# Altium project Main Board.PrjPcb
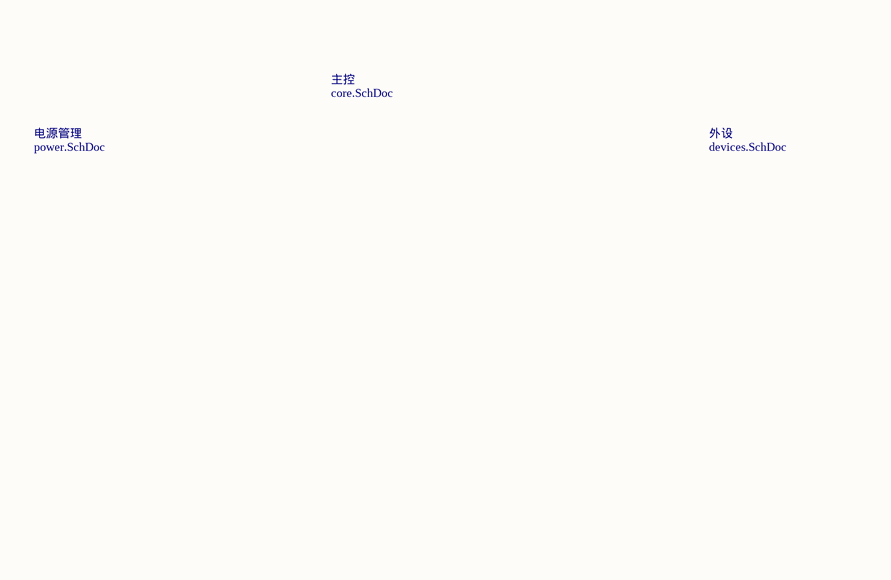
[diagram p0: main.SchDoc]
4 sheets, 71 parts. Net scope: flat (ports and power ports of the same name join across sheets).
Board file: main_board.PcbDoc
Sheets:
  main.SchDoc
    主控 = core.SchDoc
    电源管理 = power.SchDoc
    外设 = devices.SchDoc

## Sheet main.SchDoc
size A4

### Parts
LOGO1  (no value)  [JMU_LOGO(1.35cm)]

### Sub-sheets
主控 = core.SchDoc: no entries
外设 = devices.SchDoc: no entries
电源管理 = power.SchDoc: no entries

### Library data of the parts
LOGO1 = JMU_LOGO: LOGO

## Sheet core.SchDoc
size A4
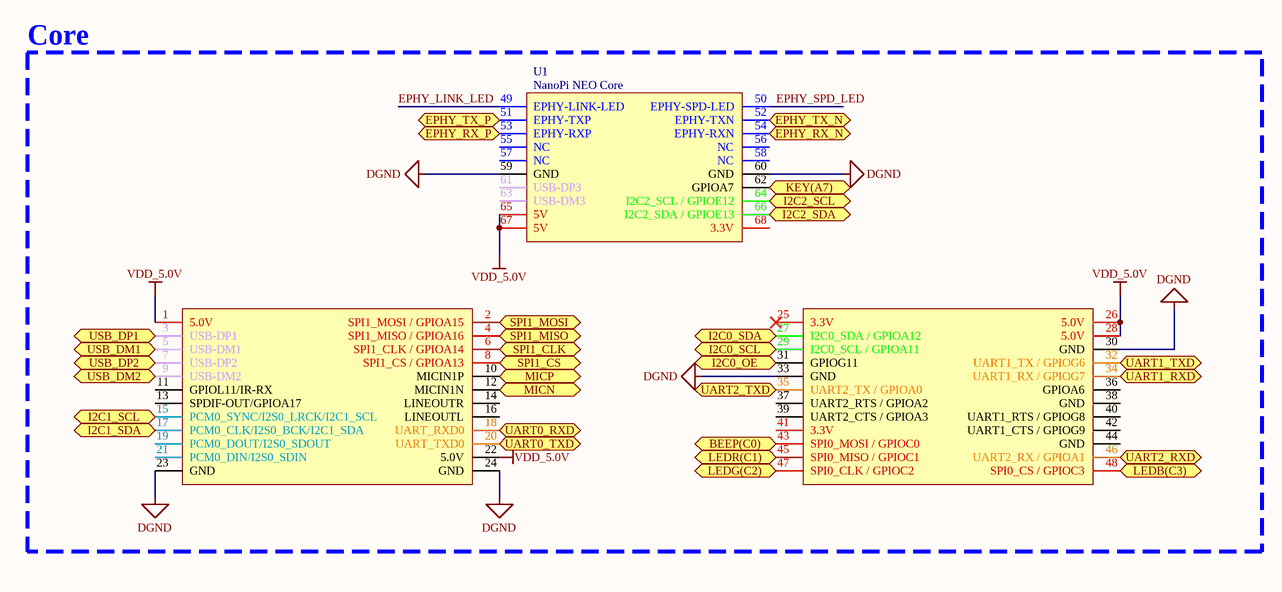
[diagram p1: core.SchDoc]

### Parts
U1  NanoPi NEO Core  [NanoPi NEO Core]

### Ports
BEEP(C0), EPHY_RX_N, EPHY_RX_P, EPHY_TX_N, EPHY_TX_P, I2C0_OE, I2C0_SCL, I2C0_SDA, I2C1_SCL, I2C1_SDA, I2C2_SCL, I2C2_SDA, KEY(A7), LEDB(C3), LEDG(C2), LEDR(C1), MICN, MICP, SPI1_CLK, SPI1_CS, SPI1_MISO, SPI1_MOSI, UART0_RXD, UART0_TXD, UART1_RXD, UART1_TXD, UART2_RXD, UART2_TXD, USB_DM1, USB_DM2, USB_DP1, USB_DP2

### Nets
DGND: U1.23(GND) U1.24(GND) U1.30(GND) U1.33(GND) U1.59(GND) U1.60(GND)
VDD_5.0V: U1.1(5.0V) U1.22(5.0V) U1.26(5.0V) U1.28(5.0V) U1.65(5V) U1.67(5V)
BEEP(C0): U1.43(SPI0_MOSI_/_GPIOC0) ; port BEEP(C0)
EPHY_LINK_LED: U1.49(EPHY-LINK-LED)
EPHY_SPD_LED: U1.50(EPHY-SPD-LED)
I2C0_OE: U1.31(GPIOG11) ; port I2C0_OE
I2C0_SCL: U1.29(I2C0_SCL_/_GPIOA11) ; port I2C0_SCL
I2C0_SDA: U1.27(I2C0_SDA_/_GPIOA12) ; port I2C0_SDA
I2C1_SCL: U1.15(PCM0_SYNC/I2S0_LRCK/I2C1_SCL) ; port I2C1_SCL
I2C1_SDA: U1.17(PCM0_CLK/I2S0_BCK/I2C1_SDA) ; port I2C1_SDA
I2C2_SCL: U1.64(I2C2_SCL_/_GPIOE12) ; port I2C2_SCL
I2C2_SDA: U1.66(I2C2_SDA_/_GPIOE13) ; port I2C2_SDA
KEY(A7): U1.62(GPIOA7) ; port KEY(A7)
LEDB(C3): U1.48(SPI0_CS_/_GPIOC3) ; port LEDB(C3)
LEDG(C2): U1.47(SPI0_CLK_/_GPIOC2) ; port LEDG(C2)
LEDR(C1): U1.45(SPI0_MISO_/_GPIOC1) ; port LEDR(C1)
MICN: U1.12(MICIN1N) ; port MICN
MICP: U1.10(MICIN1P) ; port MICP
RXIN: U1.54(EPHY-RXN) ; port EPHY_RX_N
RXIP: U1.53(EPHY-RXP) ; port EPHY_RX_P
SPI1_CLK: U1.6(SPI1_CLK_/_GPIOA14) ; port SPI1_CLK
SPI1_CS: U1.8(SPI1_CS_/_GPIOA13) ; port SPI1_CS
SPI1_MISO: U1.4(SPI1_MISO_/_GPIOA16) ; port SPI1_MISO
SPI1_MOSI: U1.2(SPI1_MOSI_/_GPIOA15) ; port SPI1_MOSI
TXON: U1.52(EPHY-TXN) ; port EPHY_TX_N
TXOP: U1.51(EPHY-TXP) ; port EPHY_TX_P
UART0_RXD: U1.18(UART_RXD0) ; port UART0_RXD
UART0_TXD: U1.20(UART_TXD0) ; port UART0_TXD
UART1_RXD: U1.34(UART1_RX_/_GPIOG7) ; port UART1_RXD
UART1_TXD: U1.32(UART1_TX_/_GPIOG6) ; port UART1_TXD
UART2_RXD: U1.46(UART2_RX_/_GPIOA1) ; port UART2_RXD
UART2_TXD: U1.35(UART2_TX_/_GPIOA0) ; port UART2_TXD
USB_DM1: U1.5(USB-DM1) ; port USB_DM1
USB_DM2: U1.9(USB-DM2) ; port USB_DM2
USB_DP1: U1.3(USB-DP1) ; port USB_DP1
USB_DP2: U1.7(USB-DP2) ; port USB_DP2

Not connected (* = marked no-connect by the designer): U1 11(GPIOL11/IR-RX) 13(SPDIF-OUT/GPIOA17) 14(LINEOUTR) 16(LINEOUTL) 19(PCM0_DOUT/I2S0_SDOUT) 21(PCM0_DIN/I2S0_SDIN) 25(3.3V)* 36(GPIOA6) 37(UART2_RTS_/_GPIOA2) 38(GND) 39(UART2_CTS_/_GPIOA3) 40(UART1_RTS_/_GPIOG8) 41(3.3V) 42(UART1_CTS_/_GPIOG9) 44(GND) 55(NC) 56(NC) 57(NC) 58(NC) 61(USB-DP3) 63(USB-DM3) 68(3.3V)

### Notes on the sheet
- Core

## Sheet power.SchDoc
size A3
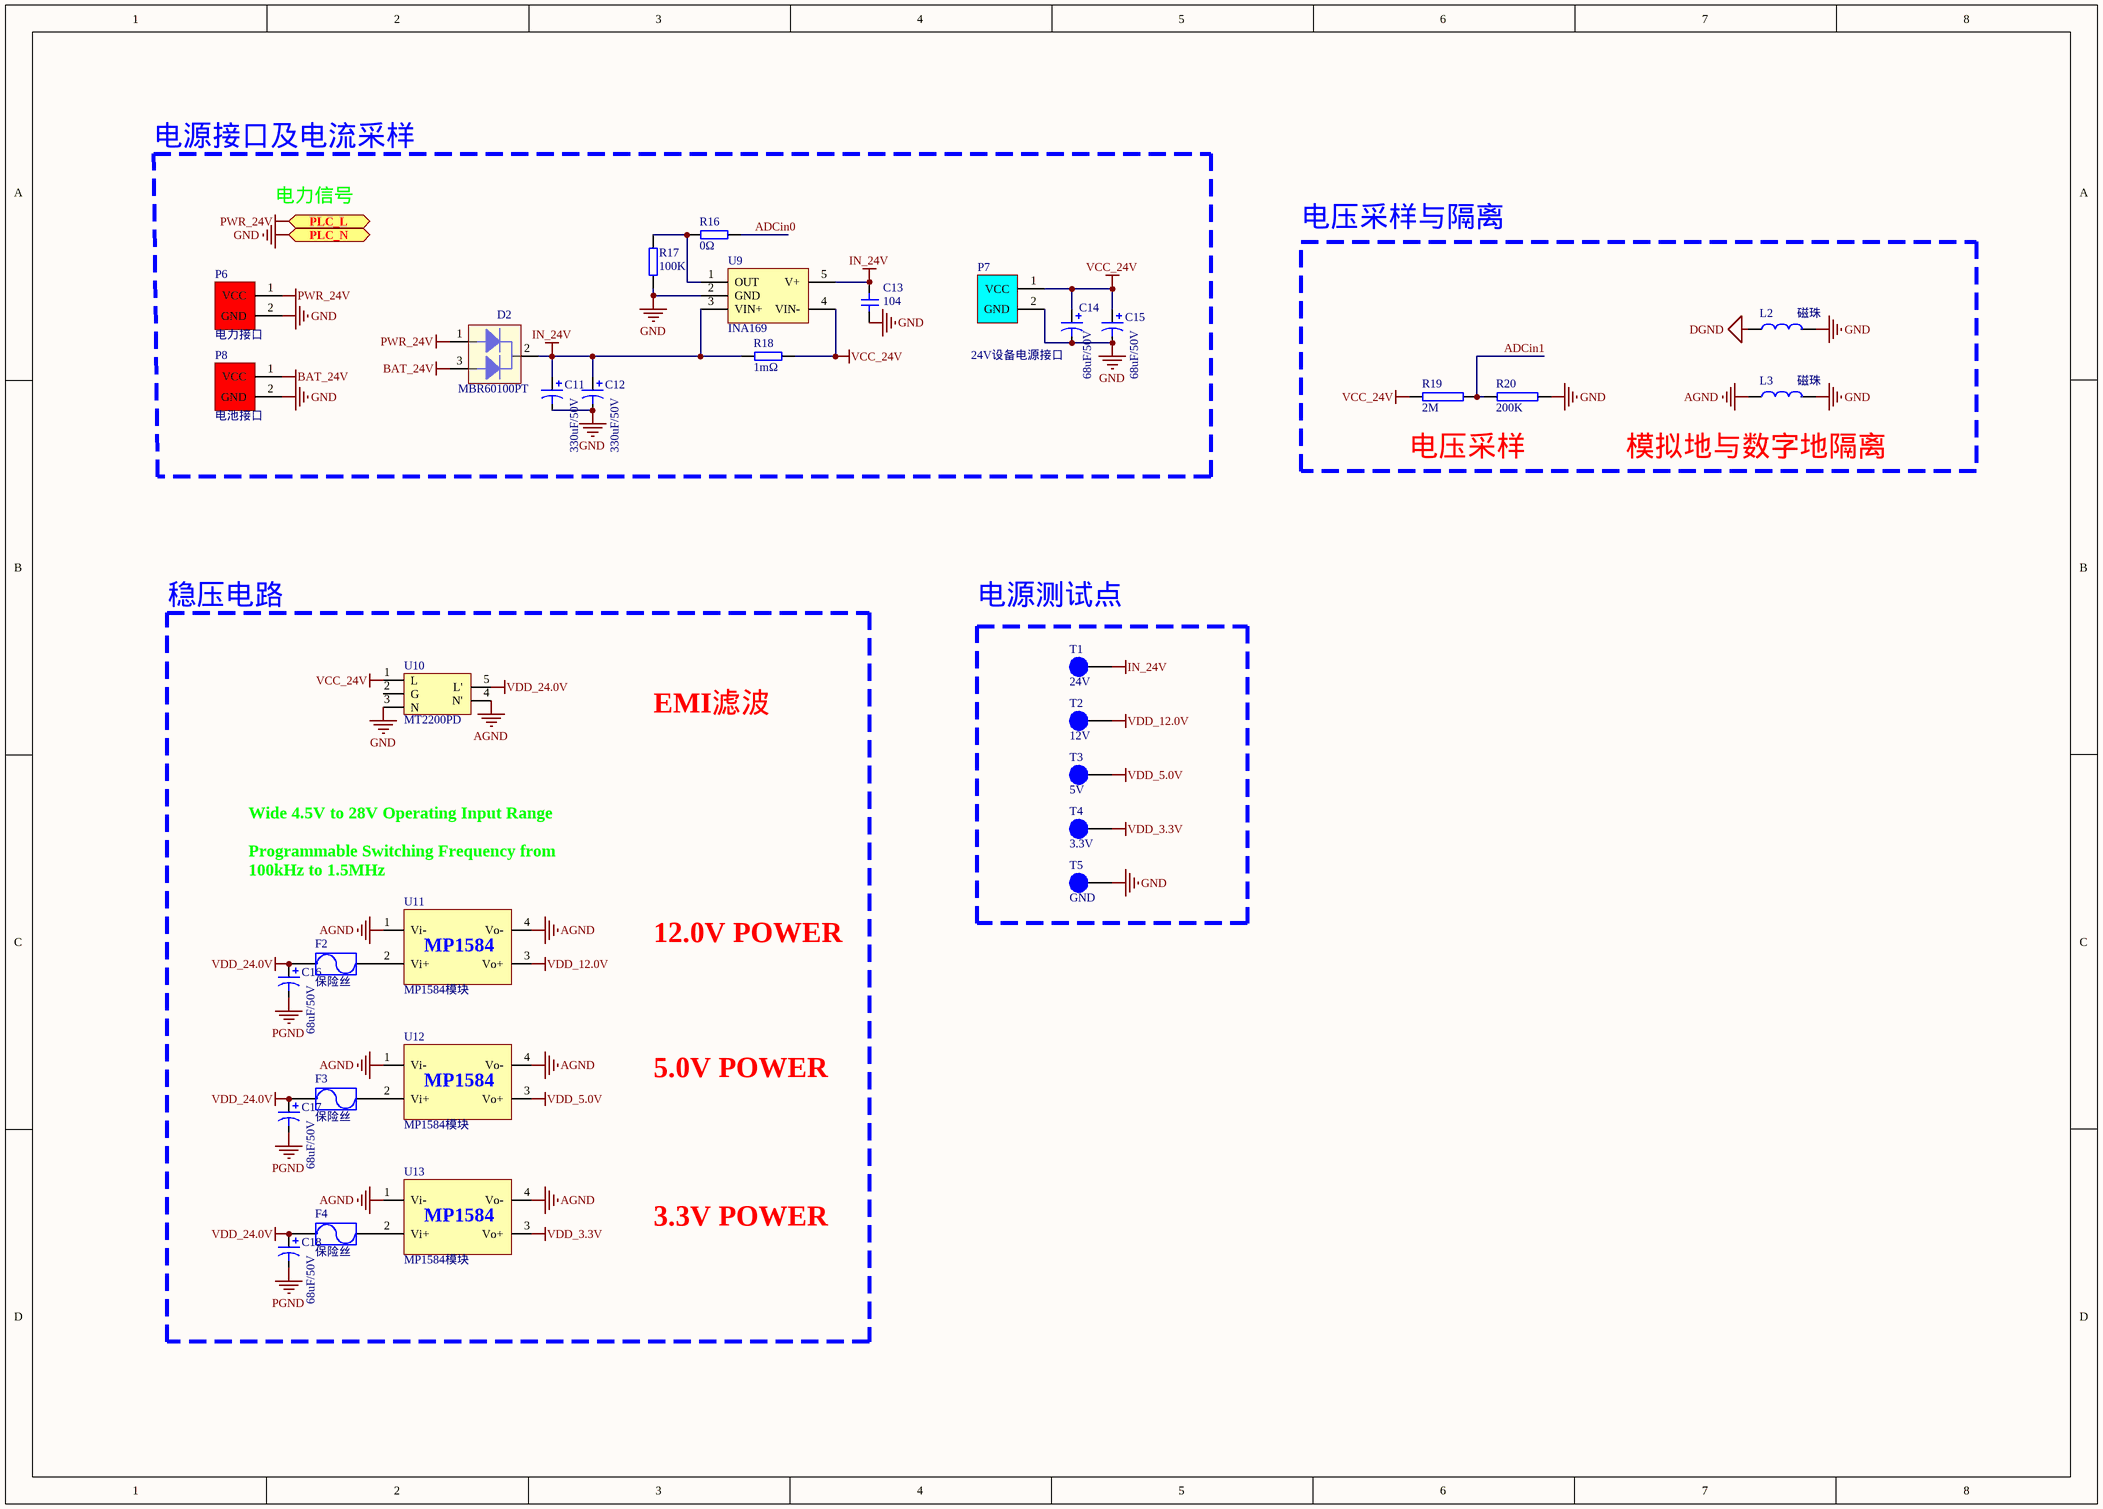
[diagram p2: power.SchDoc]

### Parts
C11  330uF/50V  [RB.2.4]
C12  330uF/50V  [RB.2.4]
C13  104  [0805C]
C14  68uF/50V  [RB.1.2]
C15  68uF/50V  [RB.1.2]
C16  68uF/50V  [RB.1.2]
C17  68uF/50V  [RB.1.2]
C18  68uF/50V  [RB.1.2]
D2  MBR60100PT  [TO-247LS]
F2  保险丝  [FUSE-1812]
F3  保险丝  [FUSE-1812]
F4  保险丝  [FUSE-1812]
L2  磁珠  [1206L]
L3  磁珠  [1206L]
P6  电力接口  [XT60-F]
P7  24V设备电源接口  [XT60-F]
P8  电池接口  [XT60-F]
R16  0Ω  [0805R]
R17  100K  [0805R]
R18  1mΩ  [2512R]
R19  2M  [0805R]
R20  200K  [0805R]
T1  24V  [HEADER 1]
T2  12V  [HEADER 1]
T3  5V  [HEADER 1]
T4  3.3V  [HEADER 1]
T5  GND  [HEADER 1]
U9  INA169  [SOT23-5]
U10  MT2200PD  [MT2200PD-6A]
U11  MP1584模块  [MP1584电源模块]
U12  MP1584模块  [MP1584电源模块]
U13  MP1584模块  [MP1584电源模块]

### Blocks framed on the sheet
电源接口及电流采样: C11-C15 D2 P6-P8 R16-R18 U9
电源测试点: T1-T5

### Ports
PLC_L, PLC_N

### Nets
AGND: L3.1 U10.4(N') U11.1(Vi-) U11.4(Vo-) U12.1(Vi-) U12.4(Vo-) U13.1(Vi-) U13.4(Vo-)
BAT_24V: D2.3 P8.1(VCC)
DGND: L2.1
GND: C11.2 C12.2 C13.1 C14.2 C15.2 L2.2 L3.2 P6.2(GND) P7.2(GND) P8.2(GND) R17.1 R20.2 T5.1 U9.2(GND) U10.3(N) ; port PLC_N
IN_24V: C11.1 C12.1 C13.2 D2.2 R18.2 T1.1 U9.3(VIN+) U9.5(V+)
PGND: C16.2 C17.2 C18.2
PWR_24V: D2.1 P6.1(VCC) ; port PLC_L
VCC_24V: C14.1 C15.1 P7.1(VCC) R18.1 R19.1 U9.4(VIN-) U10.1(L)
VDD_3.3V: T4.1 U13.3(Vo+)
VDD_5.0V: T3.1 U12.3(Vo+)
VDD_12.0V: T2.1 U11.3(Vo+)
VDD_24.0V: C16.1 C17.1 C18.1 F2.1 F3.1 F4.1 U10.5(L')
ADCin0: R16.1
ADCin1: R19.2 R20.1
NetF2_2: F2.2 U11.2(Vi+)
NetF3_2: F3.2 U12.2(Vi+)
NetF4_2: F4.2 U13.2(Vi+)
NetR16_2: R16.2 R17.2 U9.1(OUT)

Not connected (* = marked no-connect by the designer): U10 2(G)

### Notes on the sheet
- 电力信号
- 电压采样与隔离
- 电压采样
- (near L3) 模拟地与数字地隔离
- 稳压电路
- EMI滤波
- (near U11) Wide 4.5V to 28V Operating Input Range
  Programmable Switching Frequency from
  100kHz to 1.5MHz
- 12.0V POWER
- 5.0V POWER
- 3.3V POWER
- (in symbol MP1584电源模块) MP1584

### Library data of the parts
C11 C12 C14-C18 = Cap3: 直插极性电容
C13 = Cap1: 无极贴片电容
F2-F4 = Fuse
L2 L3 = L: 电感
P6 P8 = 电源端子
P7 = 推进器电源
R16-R18 = Res: 电阻
R19 R20 = R1
T1-T5 = 测试点
U11-U13 = MP1584电源模块

## Sheet devices.SchDoc
size A3
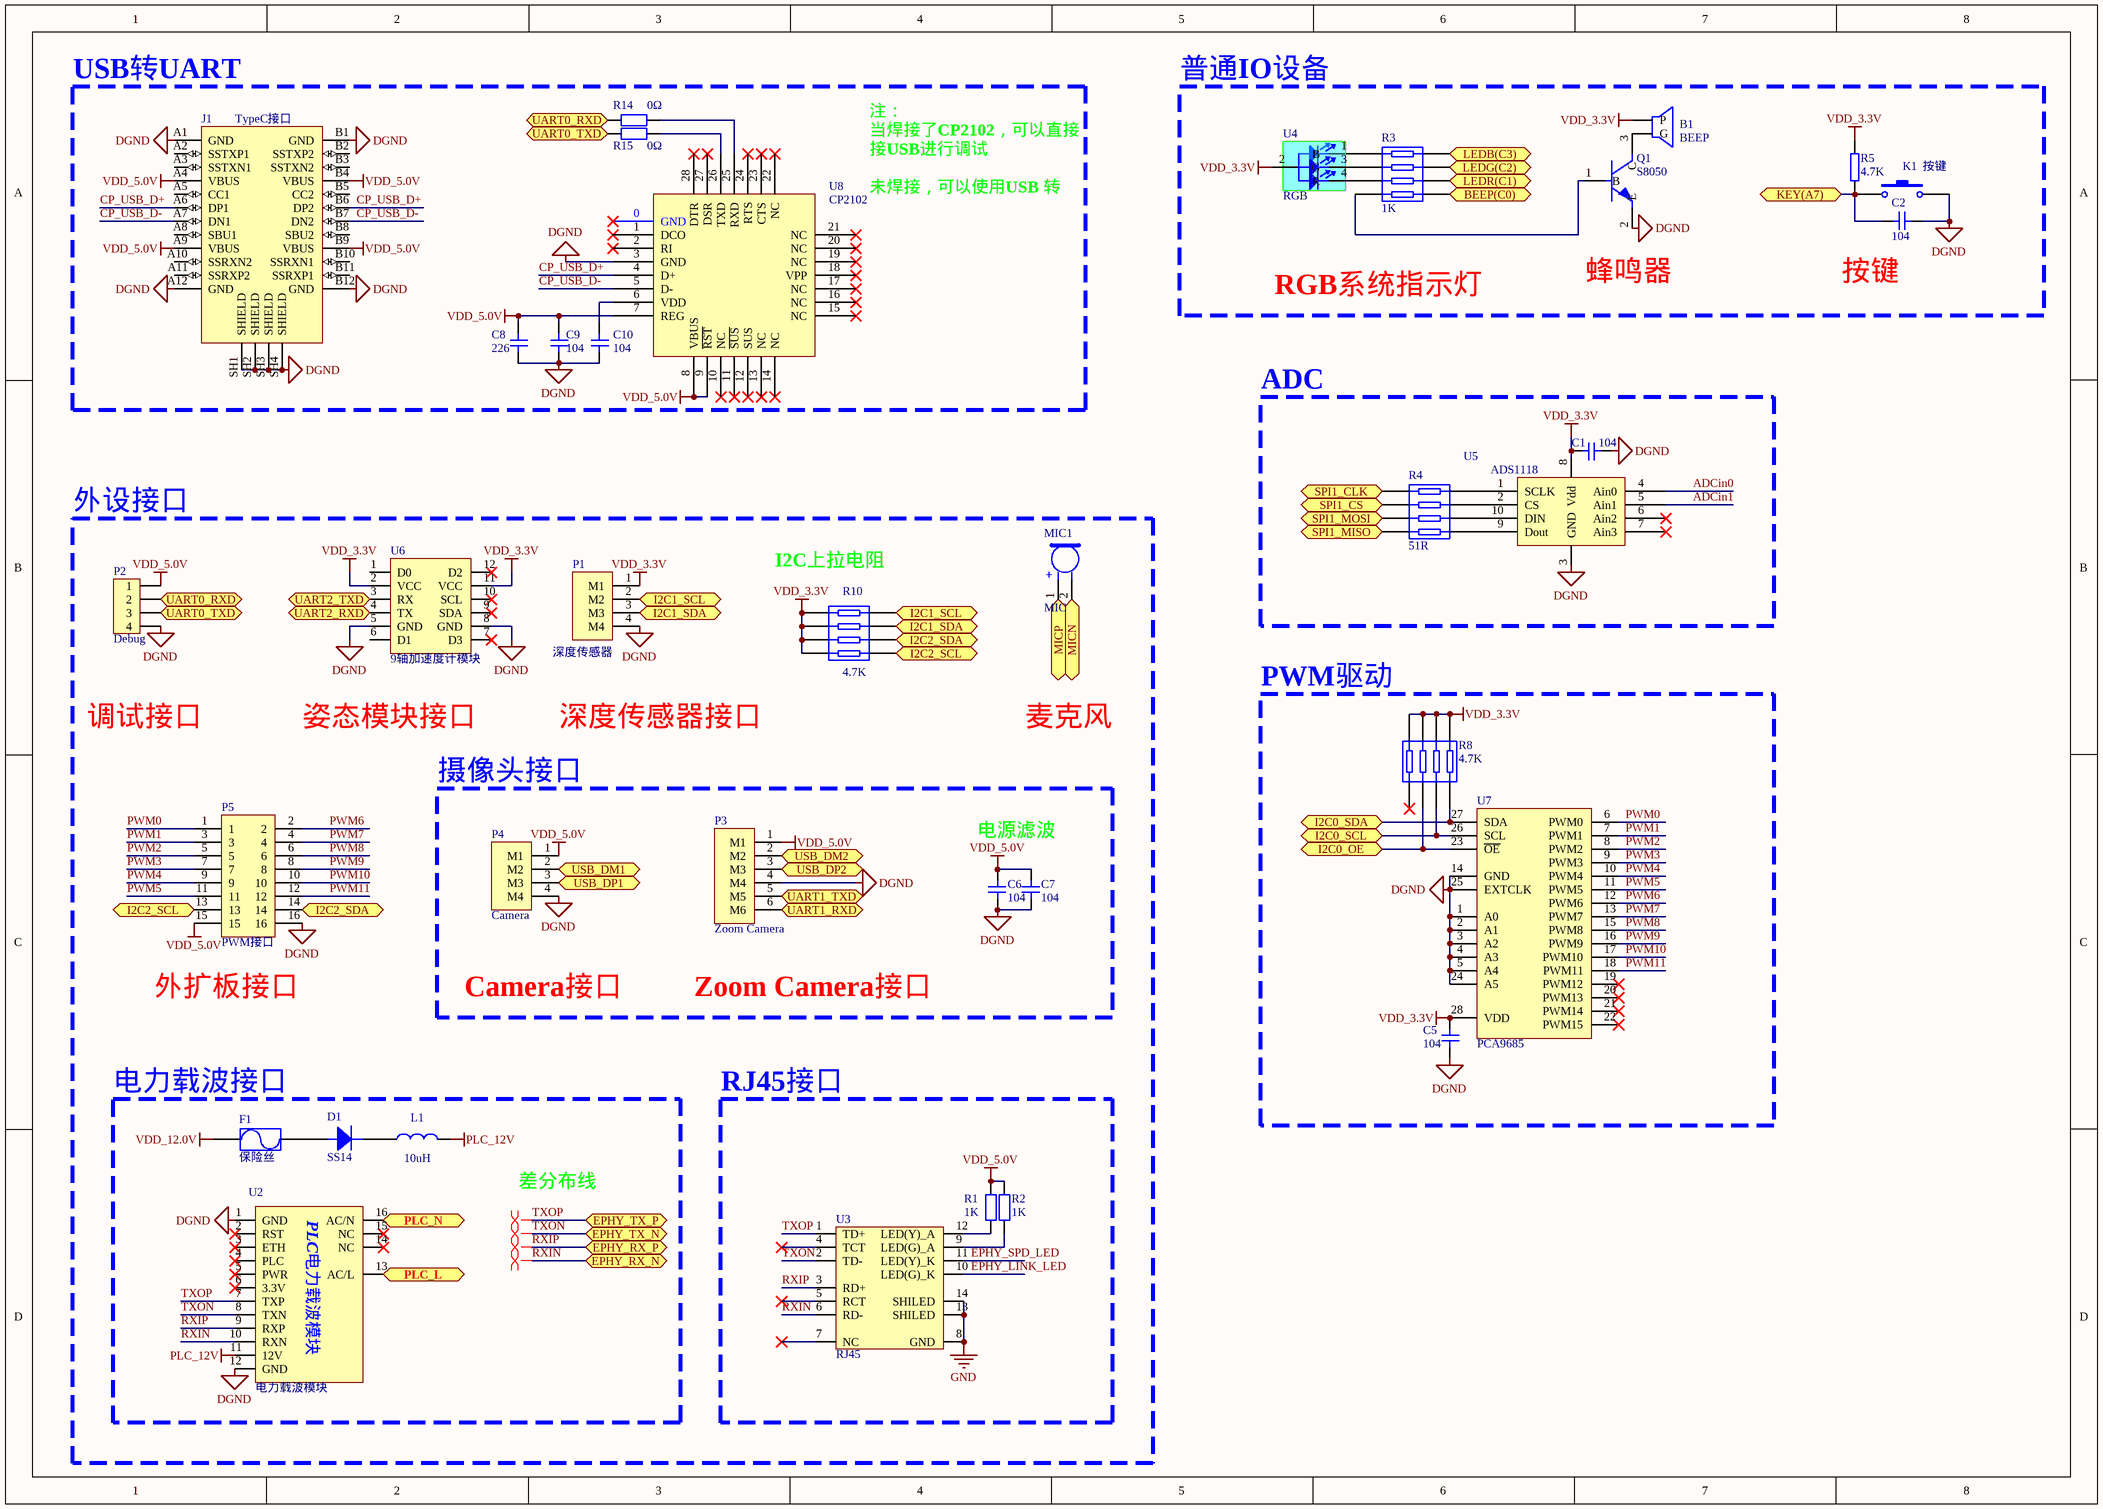
[diagram p3: devices.SchDoc]

### Parts
B1  BEEP  [BUZZER]
C1  104  [0805C]
C2  104  [0805C]
C5  104  [0805C]
C6  104  [0805C]
C7  104  [0805C]
C8  226  [0805C]
C9  104  [0805C]
C10  104  [0805C]
D1  SS14  [SMA/DO-214AC]
F1  保险丝  [FUSE-1206]
J1  TypeC接口  [Type_C-UJ31-CH-G2-SMT-TR(Primary)]
K1  按键  [贴片按键]
L1  10uH  [1206L]
MIC1  MIC  [MIC]
P1  深度传感器  [MX1.25S-4P]
P2  Debug  [Header 4(排母)]
P3  Zoom Camera  [PH2.0WS-6P]
P4  Camera  [接线端子(2.54mm)-4PIN]
P5  PWM接口  [HDR2X8/2.54-SMD]
Q1  S8050  [SOT-23]
R1  1K  [0805R]
R2  1K  [0805R]
R3  1K  [排阻(4位贴片)]
R4  51R  [排阻(4位贴片)]
R5  4.7K  [0805R]
R8  4.7K  [排阻(4位贴片)]
R10  4.7K  [排阻(4位贴片)]
R14  0Ω  [0805R]
R15  0Ω  [0805R]
U2  电力载波模块  [电力载波模块6410]
U3  RJ45  [RJ45]
U4  RGB  [RGB-3528]
U5  ADS1118  [VSSOP-10]
U6  9轴加速度计模块  [9轴加速度计]
U7  PCA9685  [TSSOP-28]
U8  CP2102  [QFN-28]

### Blocks framed on the sheet
USB转UART: C8-C10 J1 R14 R15 U8
ADC: C1 R4 U5
PWM驱动: C5 R8 U7
电力载波接口: D1 F1 L1 U2
RJ45接口: R1 R2 U3

### Ports
BEEP(C0), EPHY_RX_N, EPHY_RX_P, EPHY_TX_N, EPHY_TX_P, I2C0_OE, I2C0_SCL, I2C0_SDA, I2C1_SCL, I2C1_SDA, I2C2_SCL, I2C2_SDA, KEY(A7), LEDB(C3), LEDG(C2), LEDR(C1), MICN, MICP, PLC_L, PLC_N, SPI1_CLK, SPI1_CS, SPI1_MISO, SPI1_MOSI, UART0_RXD, UART0_TXD, UART1_RXD, UART1_TXD, UART2_RXD, UART2_TXD, USB_DM1, USB_DM2, USB_DP1, USB_DP2

### Nets
DGND: C1.2 C2.1 C5.1 C6.2 C7.2 C8.1 C9.1 C10.1 J1.A1(GND) J1.A12(GND) J1.B1(GND) J1.B12(GND) J1.SH1(SHIELD) J1.SH2(SHIELD) J1.SH3(SHIELD) J1.SH4(SHIELD) K1.2 P1.4(M4) P2.4 P3.4(M4) P4.4(M4) P5.16 Q1.2(E) U2.1(GND) U2.12(GND) U5.3(GND) U6.5(GND) U6.8(GND) U7.1(A0) U7.2(A1) U7.3(A2) U7.4(A3) U7.5(A4) U7.14(GND) U7.24(A5) U7.25(EXTCLK) U8.3(GND)
GND: U2.16(AC/N) U3.8(GND) U3.13(SHILED) U3.14(SHILED) ; port PLC_N
PLC_12V: L1.2 U2.11(12V)
PWR_24V: U2.13(AC/L) ; port PLC_L
VDD_3.3V: B1.1(P) C1.1 C5.2 P1.1(M1) R5.2 R8.1 R8.3 R8.5 R8.7 R10.2 R10.4 R10.6 R10.8 U4.2 U5.8(Vdd) U6.2(VCC) U6.11(VCC) U7.28(VDD)
VDD_5.0V: C6.1 C7.1 C8.2 C9.2 J1.A4(VBUS) J1.A9(VBUS) J1.B4(VBUS) J1.B9(VBUS) P2.1 P3.1(M1) P4.1(M1) P5.15 R1.1 R2.1 U8.7(REG) U8.8(VBUS) U8.9(~{RST})
VDD_12.0V: F1.1
ADCin0: U5.4(Ain0)
ADCin1: U5.5(Ain1)
BEEP(C0): R3.8 ; port BEEP(C0)
CP_USB_D+: J1.A6(DP1) J1.B6(DP2) U8.4(D+)
CP_USB_D-: J1.A7(DN1) J1.B7(DN2) U8.5(D-)
EPHY_LINK_LED: U3.10(LED(G)_K)
EPHY_SPD_LED: U3.11(LED(Y)_K)
I2C0_OE: R8.4 U7.23(~{OE}) ; port I2C0_OE
I2C0_SCL: R8.6 U7.26(SCL) ; port I2C0_SCL
I2C0_SDA: R8.8 U7.27(SDA) ; port I2C0_SDA
I2C1_SCL: P1.2(M2) R10.7 ; port I2C1_SCL
I2C1_SDA: P1.3(M3) R10.5 ; port I2C1_SDA
I2C2_SCL: P5.13 R10.1 ; port I2C2_SCL
I2C2_SDA: P5.14 R10.3 ; port I2C2_SDA
KEY(A7): C2.2 K1.1 R5.1 ; port KEY(A7)
LEDB(C3): R3.2 ; port LEDB(C3)
LEDG(C2): R3.4 ; port LEDG(C2)
LEDR(C1): R3.6 ; port LEDR(C1)
MICN: MIC1.2(N) ; port MICN
MICP: MIC1.1(P) ; port MICP
PWM0: P5.1 U7.6(PWM0)
PWM1: P5.3 U7.7(PWM1)
PWM2: P5.5 U7.8(PWM2)
PWM3: P5.7 U7.9(PWM3)
PWM4: P5.9 U7.10(PWM4)
PWM5: P5.11 U7.11(PWM5)
PWM6: P5.2 U7.12(PWM6)
PWM7: P5.4 U7.13(PWM7)
PWM8: P5.6 U7.15(PWM8)
PWM9: P5.8 U7.16(PWM9)
PWM10: P5.10 U7.17(PWM10)
PWM11: P5.12 U7.18(PWM11)
RXIN: U2.10(RXN) U3.6(RD-) ; port EPHY_RX_N
RXIP: U2.9(RXP) U3.3(RD+) ; port EPHY_RX_P
SPI1_CLK: R4.2 ; port SPI1_CLK
SPI1_CS: R4.4 ; port SPI1_CS
SPI1_MISO: R4.8 ; port SPI1_MISO
SPI1_MOSI: R4.6 ; port SPI1_MOSI
TXON: U2.8(TXN) U3.2(TD-) ; port EPHY_TX_N
TXOP: U2.7(TXP) U3.1(TD+) ; port EPHY_TX_P
UART0_RXD: P2.2 R14.2 ; port UART0_RXD
UART0_TXD: P2.3 R15.2 ; port UART0_TXD
UART1_RXD: P3.6(M6) ; port UART1_RXD
UART1_TXD: P3.5(M5) ; port UART1_TXD
UART2_RXD: U6.4(TX) ; port UART2_RXD
UART2_TXD: U6.3(RX) ; port UART2_TXD
USB_DM1: P4.2(M2) ; port USB_DM1
USB_DM2: P3.2(M2) ; port USB_DM2
USB_DP1: P4.3(M3) ; port USB_DP1
USB_DP2: P3.3(M3) ; port USB_DP2
NetB1_2: B1.2(G) Q1.3(C)
NetC10_2: C10.2 U8.6(VDD)
NetD1_1: D1.1 F1.2
NetD1_2: D1.2 L1.1
NetQ1_1: Q1.1(B) R3.7
NetR1_2: R1.2 U3.12(LED(Y)_A)
NetR2_2: R2.2 U3.9(LED(G)_A)
NetR3_1: R3.1 U4.1(B)
NetR3_3: R3.3 U4.3(G)
NetR3_5: R3.5 U4.4(R)
NetR4_1: R4.1 U5.1(SCLK)
NetR4_3: R4.3 U5.2(CS)
NetR4_5: R4.5 U5.10(DIN)
NetR4_7: R4.7 U5.9(Dout)
NetR14_1: R14.1 U8.25(RXD)
NetR15_1: R15.1 U8.26(TXD)

Not connected (* = marked no-connect by the designer): J1 A2(SSTXP1) A3(SSTXN1) A5(CC1) A8(SBU1) A10(SSRXN2) A11(SSRXP2) B2(SSTXP2) B3(SSTXN2) B5(CC2) B8(SBU2) B10(SSRXN1) B11(SSRXP1); R8 2*; U2 2(RST)* 3(ETH)* 4(PLC)* 5(PWR)* 6(3.3V)* 14(NC)* 15(NC)*; U3 4(TCT)* 5(RCT)* 7(NC)*; U5 6(Ain2)* 7(Ain3)*; U6 1(D0) 6(D1) 7(D3)* 9(SDA)* 10(SCL)* 12(D2)*; U7 19(PWM12)* 20(PWM13)* 21(PWM14)* 22(PWM15)*; U8 0(GND)* 1(DCO)* 2(RI)* 10(NC)* 11(~{SUS})* 12(SUS)* 13(NC)* 14(NC)* 15(NC)* 16(NC)* 17(NC)* 18(VPP)* 19(NC)* 20(NC)* 21(NC)* 22(NC)* 23(CTS)* 24(RTS)* 27(DSR)* 28(DTR)*

### Layout directives
differential pair: RXIN, RXIP, TXON, TXOP

### Notes on the sheet
- 普通IO设备
- 注：
  当焊接了CP2102，可以直接接USB进行调试
  未焊接，可以使用USB 转TTL接 Debug排针
- RGB系统指示灯
- (near Q1) 蜂鸣器
- 按键
- 外设接口
- (near R10) I2C上拉电阻
- 调试接口
- 姿态模块接口
- 摄像头接口
- 深度传感器接口
- 麦克风
- 电源滤波
- (near P5) 外扩板接口
- Camera接口
- Zoom Camera接口
- 差分布线
- (in symbol MIC) +
- (in symbol 电力载波模块6410) PLC电力载波模块

### Library data of the parts
C1 C2 C5-C10 = Cap1: 无极贴片电容
D1 = Diode: 二极管
F1 = Fuse
J1 = Type_C-24P-UJ31-CH-G2-SMT-TR: UJ31 Series Single Port 24 Contact Horizontal SMT Shielded USB-C 3.1 Receptacle
K1 = 贴片按键: 轻触开关
L1 = L: 电感
P1 P4 = 接线端子-4PIN: 4PIN
P2 = Header 4: 排针
P3 = 接线端子-6PIN: 6PIN
P5 = Header 2X8
Q1 = NPN: NPN三极管
R1 R2 R5 R14 R15 = Res: 电阻
R3 R4 R8 R10 = Res-4: 排阻
U2 = 电力载波模块6410
U6 = 9轴加速度计
U8 = CP2102: USB转串口芯片

## Nets that join several sheets
DGND: core (6 pins), power (L2.1), devices (37 pins)
GND: power (15 pins), devices (U2.16 U3.8 U3.13 U3.14)
PWR_24V: power (D2.1 P6.1), devices (U2.13)
VDD_3.3V: power (T4.1 U13.3), devices (18 pins)
VDD_5.0V: core (6 pins), power (T3.1 U12.3), devices (17 pins)
VDD_12.0V: power (T2.1 U11.3), devices (F1.1)
BEEP(C0): core (U1.43), devices (R3.8)
I2C0_OE: core (U1.31), devices (R8.4 U7.23)
I2C0_SCL: core (U1.29), devices (R8.6 U7.26)
I2C0_SDA: core (U1.27), devices (R8.8 U7.27)
I2C1_SCL: core (U1.15), devices (P1.2 R10.7)
I2C1_SDA: core (U1.17), devices (P1.3 R10.5)
I2C2_SCL: core (U1.64), devices (P5.13 R10.1)
I2C2_SDA: core (U1.66), devices (P5.14 R10.3)
KEY(A7): core (U1.62), devices (C2.2 K1.1 R5.1)
LEDB(C3): core (U1.48), devices (R3.2)
LEDG(C2): core (U1.47), devices (R3.4)
LEDR(C1): core (U1.45), devices (R3.6)
MICN: core (U1.12), devices (MIC1.2)
MICP: core (U1.10), devices (MIC1.1)
RXIN: core (U1.54), devices (U2.10 U3.6)
RXIP: core (U1.53), devices (U2.9 U3.3)
SPI1_CLK: core (U1.6), devices (R4.2)
SPI1_CS: core (U1.8), devices (R4.4)
SPI1_MISO: core (U1.4), devices (R4.8)
SPI1_MOSI: core (U1.2), devices (R4.6)
TXON: core (U1.52), devices (U2.8 U3.2)
TXOP: core (U1.51), devices (U2.7 U3.1)
UART0_RXD: core (U1.18), devices (P2.2 R14.2)
UART0_TXD: core (U1.20), devices (P2.3 R15.2)
UART1_RXD: core (U1.34), devices (P3.6)
UART1_TXD: core (U1.32), devices (P3.5)
UART2_RXD: core (U1.46), devices (U6.4)
UART2_TXD: core (U1.35), devices (U6.3)
USB_DM1: core (U1.5), devices (P4.2)
USB_DM2: core (U1.9), devices (P3.2)
USB_DP1: core (U1.3), devices (P4.3)
USB_DP2: core (U1.7), devices (P3.3)